# EAGLE design PRE (EAGLE 5.07)
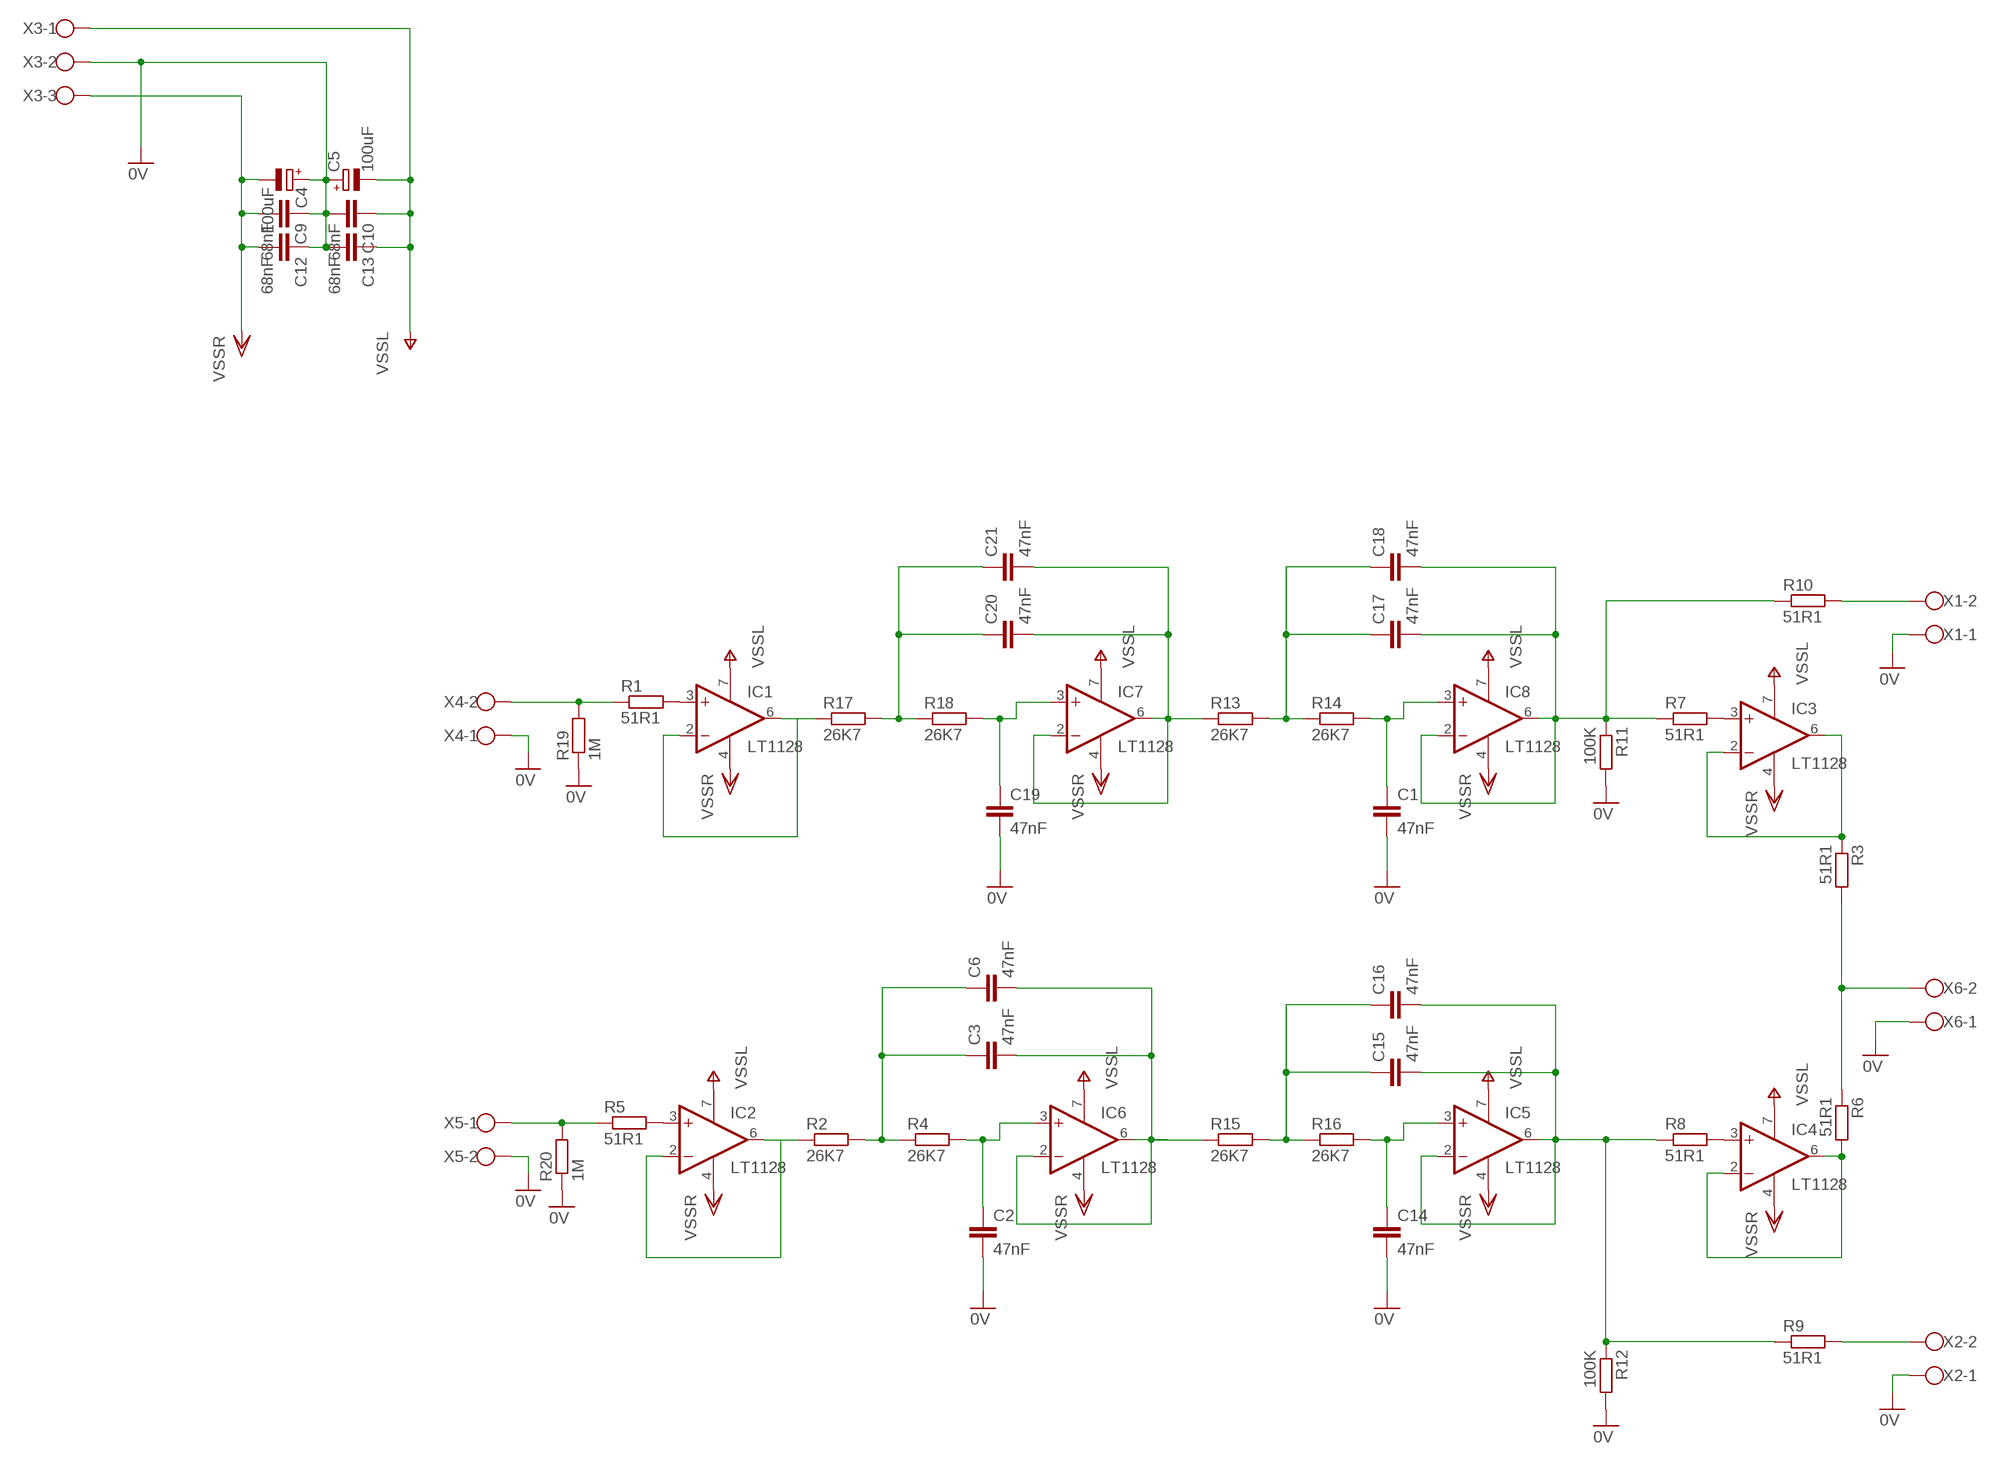
[diagram p0: schematic, sheet 1]

## Parts
C1  47nF  C-EU050-075X075  [C050-075X075]
C2  47nF  C-EU050-075X075  [C050-075X075]
C3  47nF  C-EU050-075X075  [C050-075X075]
C4  100uF  CPOL-EUE5-13  [E5-13]
C5  100uF  CPOL-EUE5-13  [E5-13]
C6  47nF  C-EU050-075X075  [C050-075X075]
C9  68nF  C-EU075-032X103  [C075-032X103]
C10  68nF  C-EU075-032X103  [C075-032X103]
C12  68nF  C-EU075-032X103  [C075-032X103]
C13  68nF  C-EU075-032X103  [C075-032X103]
C14  47nF  C-EU050-075X075  [C050-075X075]
C15  47nF  C-EU050-075X075  [C050-075X075]
C16  47nF  C-EU050-075X075  [C050-075X075]
C17  47nF  C-EU050-075X075  [C050-075X075]
C18  47nF  C-EU050-075X075  [C050-075X075]
C19  47nF  C-EU050-075X075  [C050-075X075]
C20  47nF  C-EU050-075X075  [C050-075X075]
C21  47nF  C-EU050-075X075  [C050-075X075]
IC1  LT1128  LM307N  [DIL08]
IC2  LT1128  LM307N  [DIL08]
IC3  LT1128  LM307N  [DIL08]
IC4  LT1128  LM307N  [DIL08]
IC5  LT1128  LM307N  [DIL08]
IC6  LT1128  LM307N  [DIL08]
IC7  LT1128  LM307N  [DIL08]
IC8  LT1128  LM307N  [DIL08]
R1  51R1  R-EU_0204/7  [0204/7]
R2  26K7  R-EU_0207/12  [0207/12]
R3  51R1  R-EU_0204/7  [0204/7]
R4  26K7  R-EU_0204/7  [0204/7]
R5  51R1  R-EU_0204/7  [0204/7]
R6  51R1  R-EU_0207/7  [0207/7]
R7  51R1  R-EU_0207/7  [0207/7]
R8  51R1  R-EU_0207/7  [0207/7]
R9  51R1  R-EU_0207/7  [0207/7]
R10  51R1  R-EU_0204/7  [0204/7]
R11  100K  R-EU_0204/7  [0204/7]
R12  100K  R-EU_0204/7  [0204/7]
R13  26K7  R-EU_0204/7  [0204/7]
R14  26K7  R-EU_0204/7  [0204/7]
R15  26K7  R-EU_0204/7  [0204/7]
R16  26K7  R-EU_0207/12  [0207/12]
R17  26K7  R-EU_0204/7  [0204/7]
R18  26K7  R-EU_0204/7  [0204/7]
R19  1M  R-EU_0204/7  [0204/7]
R20  1M  R-EU_0204/7  [0204/7]
X1  W237-02P  [W237-132]
X2  W237-02P  [W237-132]
X3  W237-03P  [W237-133]
X4  W237-02P  [W237-132]
X5  W237-02P  [W237-132]
X6  W237-02P  [W237-132]

## Nets
0V: C1.2 C2.2 C4.+ C5.+ C9.1 C10.2 C12.1 C13.2 C14.2 C19.2 R11.2 R12.2 R19.1 R20.1 X1.1 X2.1 X3.2 X4.1 X5.2 X6.1
N$1: IC1.2(-IN) IC1.6(OUT) R17.1
N$2: C20.1 C21.1 R17.2 R18.1
N$3: C20.2 C21.2 IC7.2(-IN) IC7.6(OUT) R13.1
N$4: IC3.2(-IN) IC3.6(OUT) R3.1
N$5: IC4.2(-IN) IC4.6(OUT) R6.2
N$7: C3.2 C6.2 IC6.2(-IN) IC6.6(OUT) R15.1
N$8: IC2.2(-IN) IC2.6(OUT) R2.1
N$9: IC3.3(+IN) R7.2
N$11: R3.2 R6.1 X6.2
N$12: IC4.3(+IN) R8.2
N$13: C17.2 C18.2 IC8.2(-IN) IC8.6(OUT) R7.1 R10.1 R11.1
N$14: C15.2 C16.2 IC5.2(-IN) IC5.6(OUT) R8.1 R9.1 R12.1
N$15: R10.2 X1.2
N$16: R9.2 X2.2
N$17: C17.1 C18.1 R13.2 R14.1
N$18: C1.1 IC8.3(+IN) R14.2
N$19: C15.1 C16.1 R15.2 R16.1
N$20: C14.1 IC5.3(+IN) R16.2
N$21: C19.1 IC7.3(+IN) R18.2
N$22: C3.1 C6.1 R2.2 R4.1
N$23: C2.1 IC6.3(+IN) R4.2
N$25: IC1.3(+IN) R1.2
N$26: IC2.3(+IN) R5.2
N$29: R5.1 R20.2 X5.1
N$30: R1.1 R19.2 X4.2
V-: C5.- C10.1 C13.1 IC1.7(V+) IC2.7(V+) IC3.7(V+) IC4.7(V+) IC5.7(V+) IC6.7(V+) IC7.7(V+) IC8.7(V+) X3.1 ; supply symbol labelled VSSL
VSS: C4.- C9.2 C12.2 IC1.4(V-) IC2.4(V-) IC3.4(V-) IC4.4(V-) IC5.4(V-) IC6.4(V-) IC7.4(V-) IC8.4(V-) X3.3 ; supply symbol labelled VSSR

## Library data of the parts
C1-C3 C6 C9 C10 C12-C21 = resistor:C-EU: CAPACITOR, European symbol
C4 C5 = resistor:CPOL-EU: POLARIZED CAPACITOR, European symbol
IC1-IC8 = linear:LM307: OP AMP
R1-R20 = resistor:R-EU_: RESISTOR, European symbol
X1 X2 X4-X6 = con-wago-508:W237-02P: WAGO SREW CLAMP
X3 = con-wago-508:W237-03P: WAGO SREW CLAMP

## Board
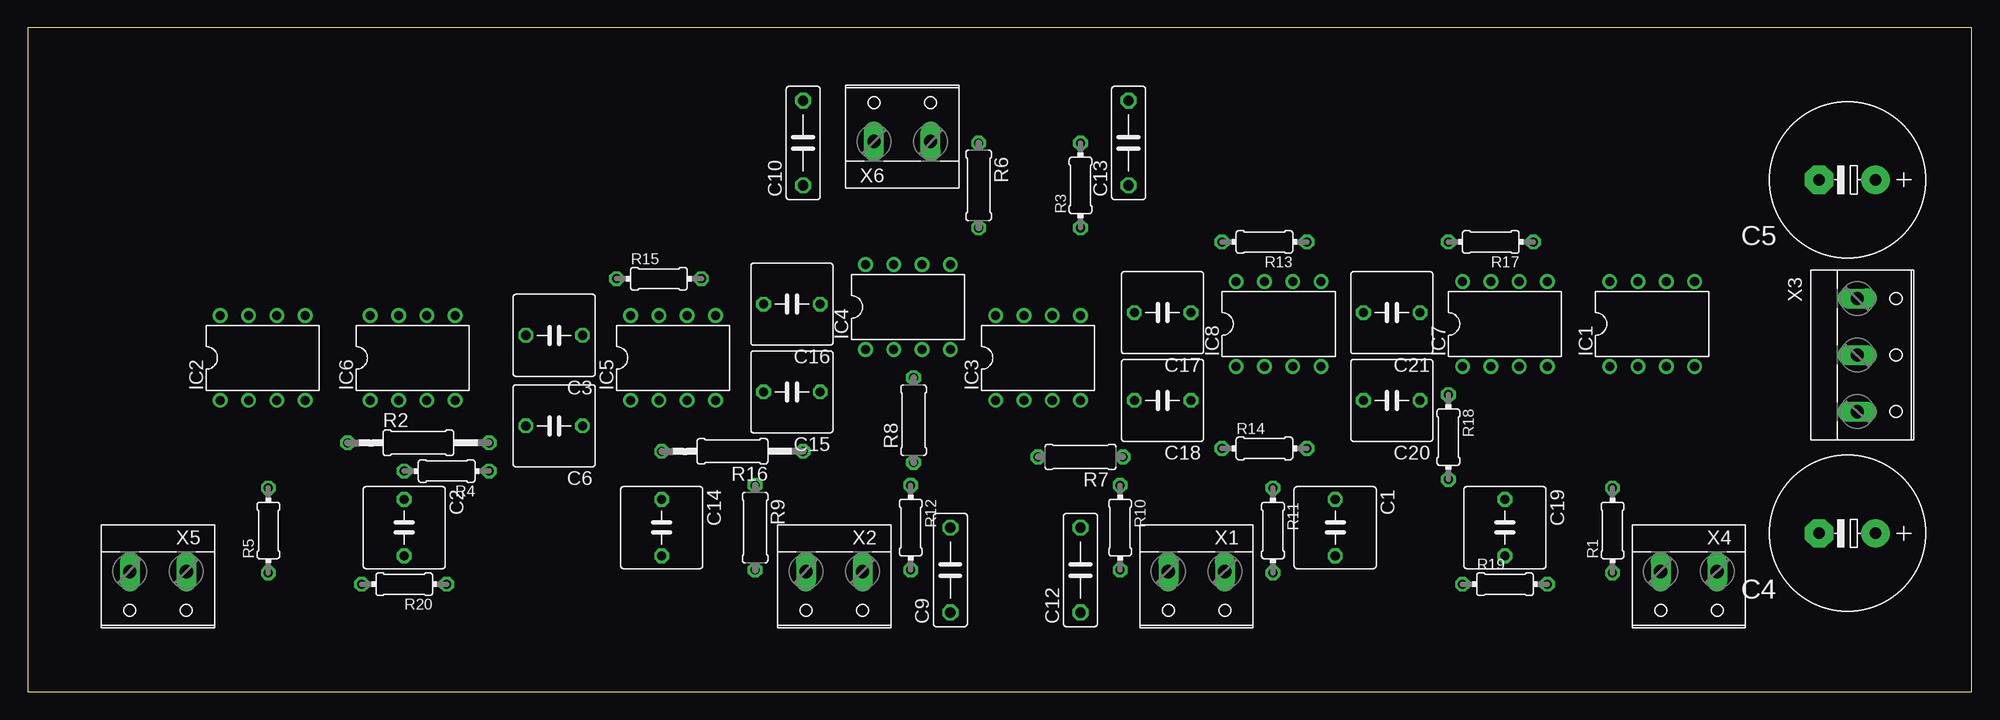
[diagram p1: board, top side]
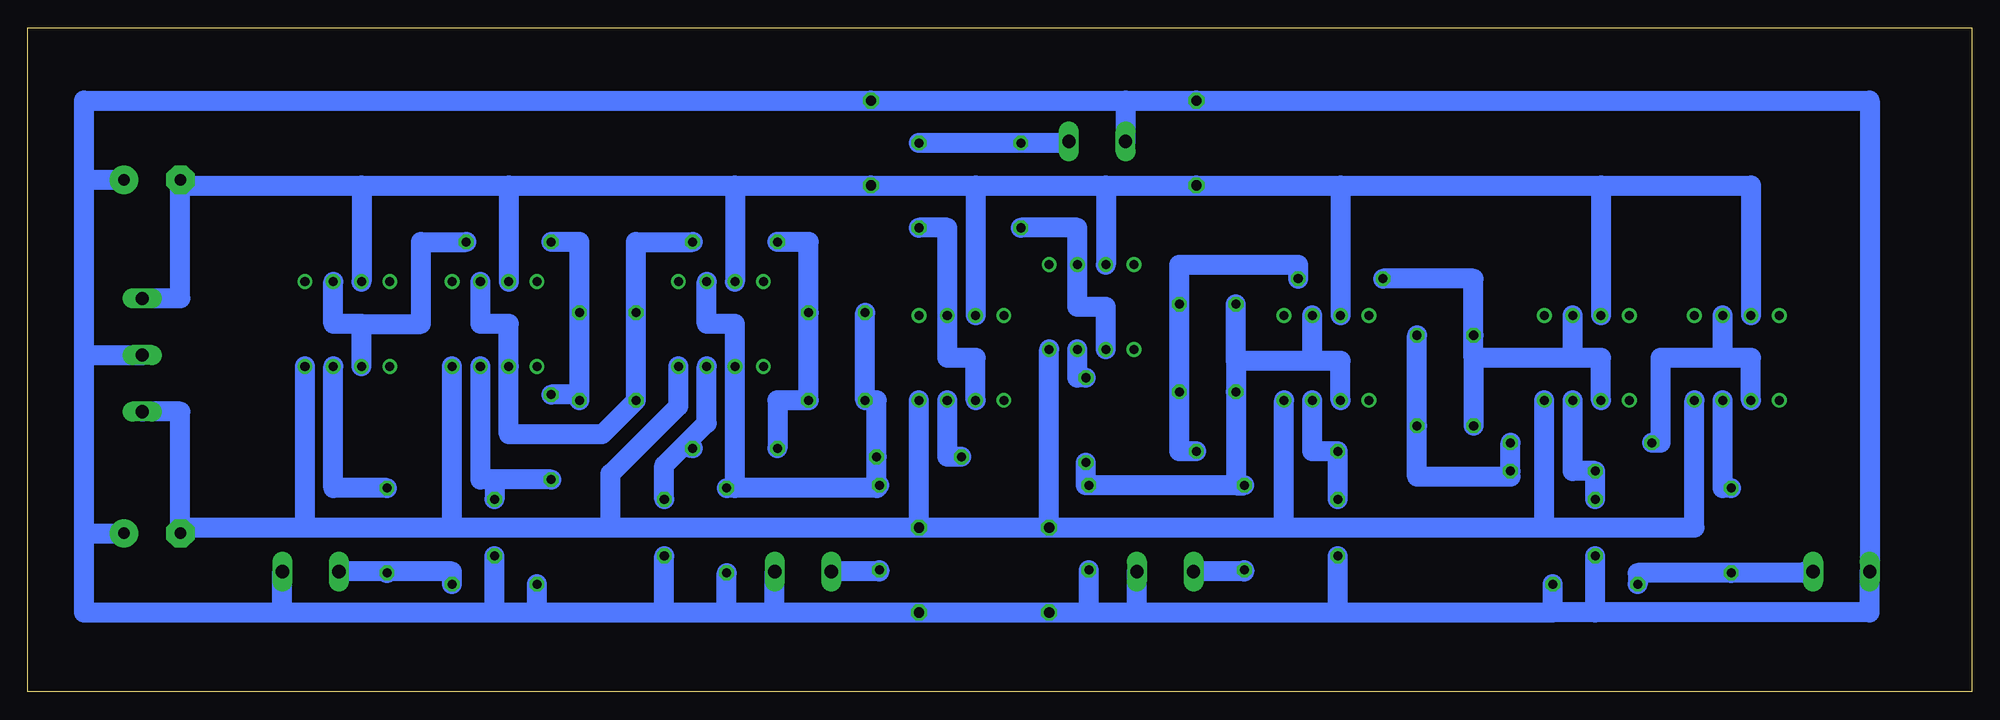
[diagram p2: board, bottom side, seen from below]

Size 174.48 x 59.61 mm. Coordinates in mm from the lower left corner, seen from the top.
Outline: 0,0 174.48,0 174.48,59.61 0,59.61 0,0
Copper layers (1*16): Top 0.035mm / dielectric 1.5mm / Bottom 0.035mm
Design rules "default": minimum track width 10mil, minimum drill 24mil, track to track 8mil, track to pad 8mil, pad to pad 8mil, via to via 8mil, smd to smd 8mil, copper to edge 40mil, drill to drill 8mil, minimum pad ring 10mil, minimum via ring 8mil, stop-mask expansion 4mil, vias tented up to drill 0mil, thermal gap 10mil

### Footprints (pad centres in the part's own frame; a part is rotated, then mirrored left to right if it is on the bottom)
C050-075X075 = drill 0.813 octagon: 1 -2.54,0; 2 2.54,0
E5-13 = drill 1.016 pad 2.54 round: + -2.54,0 | drill 1.016 pad 2.54 octagon: - 2.54,0
C075-032X103 = drill 0.914 octagon: 1 -3.81,0; 2 3.81,0
DIL08 = drill 0.813 pad 1.27 round: 1 -3.81,-3.81; 2 -1.27,-3.81; 3 1.27,-3.81; 4 3.81,-3.81; 5 3.81,3.81; 6 1.27,3.81; 7 -1.27,3.81; 8 -3.81,3.81
0204/7 = drill 0.813 octagon: 1 -3.81,0; 2 3.81,0
0207/12 = drill 0.813 octagon: 1 -6.35,0; 2 6.35,0
0207/7 = drill 0.813 octagon: 1 -3.81,0; 2 3.81,0
W237-132 = drill 1.194 long: 1 -2.54,-0.635; 2 2.54,-0.635
W237-133 = drill 1.194 long: 1 -5.08,-0.635; 2 0,-0.635; 3 5.08,-0.635

### Placement (x,y rotation side)
C1  117.35,14.73 270 top
C2  33.78,14.73 270 top
C3  47.24,32 180 top
C4  163.32,14.22 180 top
C5  163.32,45.97 180 top
C6  47.24,23.88 180 top
C9  82.8,10.92 90 top
C10  69.6,49.28 90 top
C12  94.49,10.92 90 top
C13  98.81,49.28 90 top
C14  56.9,14.73 270 top
C15  68.58,26.92 180 top
C16  68.58,34.8 180 top
C17  101.85,34.04 180 top
C18  101.85,26.16 180 top
C19  132.59,14.73 270 top
C20  122.43,26.16 180 top
C21  122.43,34.04 180 top
IC1  145.8,33.02 0 top
IC2  21.08,29.97 0 top
IC3  90.68,29.97 0 top
IC4  78.99,34.54 0 top
IC5  57.91,29.97 0 top
IC6  34.54,29.97 0 top
IC7  132.59,33.02 0 top
IC8  112.27,33.02 0 top
R1  142.24,14.48 90 top
R2  35.05,22.35 0 top
R3  94.49,45.47 90 top
R4  37.59,19.81 180 top
R5  21.59,14.48 90 top
R6  85.34,45.47 270 top
R7  94.49,21.08 180 top
R8  79.5,24.38 90 top
R9  65.28,14.73 270 top
R10  98.04,14.73 270 top
R11  111.76,14.48 270 top
R12  79.25,14.73 270 top
R13  111,40.39 180 top
R14  111,21.84 0 top
R15  56.64,37.08 0 top
R16  63.25,21.59 180 top
R17  131.32,40.39 180 top
R18  127.51,22.86 270 top
R19  132.59,9.65 0 top
R20  33.78,9.65 180 top
X1  104.9,10.16 180 top
X2  72.39,10.16 180 top
X3  164.85,30.23 270 top
X4  149.1,10.16 180 top
X5  11.68,10.16 180 top
X6  78.49,50.04 0 top

### Tracks (layer width: path | path; a pad name or v marks a point on that pad's centre or on a via)
0V
  Bottom 1.778: 79.25,7.11 C9.1 C12.1 107.44,7.11 | 79.25,7.11 74.93,7.11 | 33.78,7.11 9.14,7.11 X5.2 9.14,53.09 C10.2 75.95,53.09 | 33.78,7.11 37.59,7.11 | 74.93,7.11 56.9,7.11 | 169.42,45.97 169.42,53.09 C13.2 75.95,53.09 | 169.42,30.23 169.42,45.97 | 169.42,14.22 169.42,7.11 151.64,7.11 | 151.64,7.11 132.59,7.11 | 132.59,7.11 128.78,7.11 | 128.78,7.11 117.35,7.11 | 117.35,7.11 111.76,7.11 | 111.76,7.11 107.44,7.11 | 75.95,53.09 X6.1 | 74.93,7.11 X2.1 | 79.25,7.11 R12.2 | 107.44,7.11 X1.1 | 111.76,7.11 R11.2 | 117.35,7.11 C1.2 | 132.59,7.11 C19.2 | 56.9,7.11 C14.2 | 33.78,7.11 C2.2 | 169.42,45.97 C5.+ | 169.42,14.22 C4.+ | 169.42,14.22 169.42,30.23 | 169.42,30.23 X3.2 | 151.64,7.11 X4.1 | 37.59,7.11 R20.1 | 56.9,7.11 37.59,7.11 | 128.78,7.11 R19.1
N$1
  Bottom 1.778: IC1.6 147.07,33.02 144.53,33.02 | IC1.2 144.53,33.02 | R17.1 139.19,40.39 139.19,33.02 144.53,33.02
N$2
  Bottom 1.778: 124.97,26.67 C21.1 124.97,40.39 R17.2 | 124.97,26.67 R18.1 | C20.1 124.97,26.67
N$3
  Bottom 1.778: IC7.6 133.86,33.02 131.32,33.02 IC7.2 131.32,23.11 122.94,23.11 C20.2 C21.2 119.89,40.39 R13.1
N$4
  Bottom 1.778: IC3.2 89.41,29.97 91.95,29.97 IC3.6 91.95,41.66 R3.1
N$5
  Bottom 1.778: IC4.2 77.72,34.54 80.26,34.54 IC4.6 80.26,41.66 R6.2
N$7
  Bottom 1.778: IC6.2 33.27,29.97 35.81,29.97 | 44.7,29.97 C6.2 | 44.7,29.97 C3.2 44.7,37.08 R15.1 | 35.81,29.97 IC6.6 | 35.81,29.97 44.7,29.97
N$8
  Bottom 1.778: IC2.2 19.81,29.97 22.35,29.97 | 22.35,29.97 IC2.6 | R2.1 27.94,22.35 27.94,29.97 22.35,29.97
N$9
  Bottom 1.778: IC3.3 91.95,21.08 R7.2
N$11
  Bottom 1.778: X6.2 81.79,49.28 R6.1 R3.2
N$12
  Bottom 1.778: IC4.3 80.26,28.19 R8.2
N$13
  Bottom 1.778: R10.1 98.3,18.29 | 98.3,18.29 R7.1 98.3,26.16 C18.2 C17.2 | 98.3,18.29 111,18.29 | 111,18.29 R11.1 | IC8.6 113.54,33.02 111,33.02 IC8.2 111,18.29
N$14
  Bottom 1.778: 66.04,18.54 R9.1 | 66.04,18.54 R12.1 79.5,18.54 R8.1 | 59.18,29.72 IC5.6 | 59.18,29.72 56.64,29.72 IC5.2 | 66.04,29.72 C15.2 66.04,18.54 | 66.04,29.72 C16.2 | 59.18,29.72 66.04,29.72
N$15
  Bottom 1.778: R10.2 98.04,10.79 X1.2
N$16
  Bottom 1.778: R9.2 65.28,10.79 X2.2
N$17
  Bottom 1.778: R14.1 107.19,26.16 C18.1 C17.1 104.39,40.39 R13.2
N$18
  Bottom 1.778: 115.57,22.1 R14.2 | IC8.3 113.54,24.13 115.57,22.1 | 115.57,22.1 117.35,20.32 C1.1
N$19
  Bottom 1.778: R16.1 71.12,21.59 C15.1 C16.1 71.12,38.35 60.45,38.35 R15.2
N$20
  Bottom 1.778: IC5.3 59.18,21.59 R16.2 C14.1
N$21
  Bottom 1.778: 132.59,19.05 C19.1 | R18.2 132.59,19.05 | IC7.3 133.86,19.05 132.59,19.05
N$22
  Bottom 1.778: C3.1 C6.1 49.78,19.3 41.4,19.3 R4.1 R2.2
N$23
  Bottom 1.778: C2.1 R4.2 35.81,19.81 IC6.3
N$25
  Bottom 1.778: R1.2 147.07,18.29 IC1.3
N$26
  Bottom 1.778: R5.2 22.35,18.29 IC2.3
N$29
  Bottom 1.778: R20.2 29.97,10.67 R5.1 14.99,10.67 14.99,10.79 X5.1
N$30
  Bottom 1.778: 142.24,10.79 136.4,10.79 R19.2 | 142.24,10.79 X4.2 | 142.24,10.79 R1.1
V-
  Bottom 1.778: 77.72,45.47 C10.1 56.64,45.47 | 89.41,45.47 77.72,45.47 | 89.41,45.47 C13.1 111,45.47 | 131.32,45.47 111,45.47 | 144.53,45.47 131.32,45.47 | 160.78,45.47 144.53,45.47 | 160.78,45.47 C5.- | 77.72,45.47 IC4.7 | 56.64,45.47 IC5.7 | 111,45.47 IC8.7 | 131.32,45.47 IC7.7 | 33.27,45.47 IC6.7 | 56.64,45.47 33.27,45.47 | 89.41,45.47 IC3.7 | X3.1 160.78,35.31 160.78,45.47 | 144.53,45.47 IC1.7 | IC2.7 19.81,45.47 33.27,45.47
VSS
  Bottom 1.778: C4.- 160.78,14.73 | C12.2 C9.2 | C9.2 IC4.4 | C12.2 IC3.4 | 122.17,14.73 C12.2 | 136.4,14.73 122.17,14.73 | 149.61,14.73 136.4,14.73 | 160.78,14.73 149.61,14.73 | 136.4,14.73 IC7.4 | IC8.4 116.08,25.65 122.17,19.56 122.17,14.73 | C9.2 61.72,14.73 | 61.72,14.73 IC5.4 | 61.72,14.73 38.35,14.73 | 38.35,14.73 IC6.4 | X3.3 160.78,25.15 160.78,14.73 | 149.61,14.73 IC1.4 | IC2.4 24.89,14.73 38.35,14.73